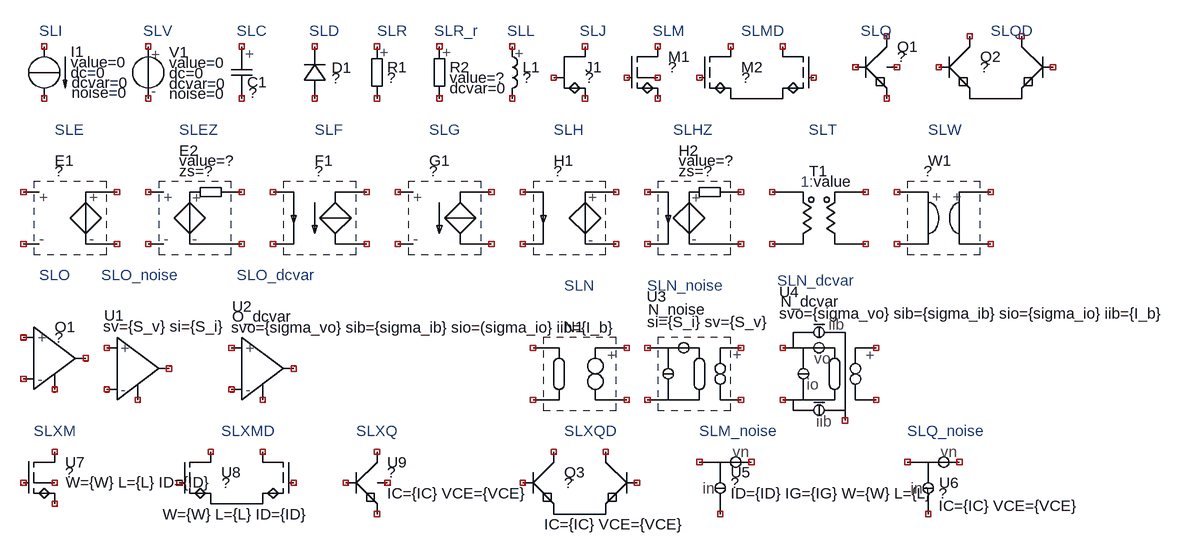
[diagram p0: schematic SLiCAPsymbolsLTSpice.asc]
SLiCAPsymbolsLTSpice.asc, the LTspice schematic file:
Version 4
SHEET 1 1264 1580
SYMBOL SLC -528 -320 R0
WINDOW 3 11 71 Left 2
SYMATTR InstName C1
SYMBOL SLE -784 -112 R0
SYMATTR InstName E1
SYMBOL SLI -832 -320 R0
SYMATTR InstName I1
SYMBOL SLD -416 -320 R0
SYMATTR InstName D1
SYMBOL SLF -400 -112 R0
SYMATTR InstName F1
SYMBOL SLG -208 -112 R0
SYMATTR InstName G1
SYMBOL SLH -16 -112 R0
SYMATTR InstName H1
SYMBOL SLEZ -592 -112 R0
SYMATTR InstName E2
SYMBOL SLHZ 176 -112 R0
SYMATTR InstName H2
SYMBOL SLJ -48 -320 R0
SYMATTR InstName J1
SYMBOL SLL -112 -240 R0
SYMATTR InstName L1
SYMBOL SLM 64 -272 R0
SYMATTR InstName M1
SYMBOL SLV -672 -320 R0
SYMATTR InstName V1
SYMBOL SLMD 176 -272 R0
SYMATTR InstName M2
SYMATTR Description MOSFET transistor
SYMBOL SLN 0 128 R0
SYMATTR InstName N1
SYMBOL SLO -848 160 R0
SYMATTR InstName O1
SYMBOL SLQ 416 -288 R0
SYMATTR InstName Q1
SYMBOL SLQD 544 -336 R0
SYMATTR InstName Q2
SYMBOL SLR -320 -320 R0
SYMATTR InstName R1
SYMBOL SLR_r -224 -320 R0
SYMATTR InstName R2
SYMBOL SLT 368 -112 R0
SYMATTR InstName T1
SYMBOL SLW 544 -112 R0
SYMATTR InstName W1
SYMBOL SLN_noise 176 128 R0
WINDOW 0 -81 -63 Left 2
WINDOW 38 -79 -43 Left 2
WINDOW 3 -80 -24 Left 2
SYMATTR InstName U3
SYMBOL SLN_dcvar 304 224 R0
WINDOW 0 -5 -166 Left 2
WINDOW 3 -5 -133 Left 2
WINDOW 38 -3 -151 Left 2
SYMATTR InstName U4
SYMBOL SLO_noise -720 176 R0
WINDOW 0 -20 -82 Left 2
WINDOW 3 -21 -65 Left 2
SYMATTR InstName U1
SYMBOL SLM_noise 256 304 R0
SYMATTR InstName U5
SYMBOL SLQ_noise 576 304 R0
SYMATTR InstName U6
SYMBOL SLXM -864 352 R0
SYMATTR InstName U7
SYMBOL SLXMD -624 352 R0
SYMATTR InstName U8
SYMBOL SLXQ -368 352 R0
SYMATTR InstName U9
SYMBOL SLXQD -96 304 R0
SYMATTR InstName Q3
SYMBOL SLO_dcvar -528 176 R0
SYMATTR InstName U2
TEXT -840 -344 Left 2 ;SLI
TEXT -680 -344 Left 2 ;SLV
TEXT -536 -344 Left 2 ;SLC
TEXT -424 -344 Left 2 ;SLD
TEXT -320 -344 Left 2 ;SLR
TEXT -232 -344 Left 2 ;SLR_r
TEXT -120 -344 Left 2 ;SLL
TEXT -8 -344 Left 2 ;SLJ
TEXT 104 -344 Left 2 ;SLM
TEXT 240 -344 Left 2 ;SLMD
TEXT 424 -344 Left 2 ;SLQ
TEXT 624 -344 Left 2 ;SLQD
TEXT -816 -192 Left 2 ;SLE
TEXT -624 -192 Left 2 ;SLEZ
TEXT -416 -192 Left 2 ;SLF
TEXT -240 -192 Left 2 ;SLG
TEXT -48 -192 Left 2 ;SLH
TEXT 136 -192 Left 2 ;SLHZ
TEXT 344 -192 Left 2 ;SLT
TEXT 528 -192 Left 2 ;SLW
TEXT -840 32 Left 2 ;SLO
TEXT -744 32 Left 2 ;SLO_noise
TEXT -536 32 Left 2 ;SLO_dcvar
TEXT -32 48 Left 2 ;SLN
TEXT 96 48 Left 2 ;SLN_noise
TEXT 296 40 Left 2 ;SLN_dcvar
TEXT -352 272 Left 2 ;SLXQ
TEXT -560 272 Left 2 ;SLXMD
TEXT -848 272 Left 2 ;SLXM
TEXT -32 272 Left 2 ;SLXQD
TEXT 176 272 Left 2 ;SLM_noise
TEXT 496 272 Left 2 ;SLQ_noise

The netlist it stands for:
* SLiCAPsymbolsLTSpice.asc
C1 NC_01 NC_02 ?
E1 NC_03 NC_04 NC_05 NC_06 ?
I1 NC_07 NC_08 I value=0 dc=0 dcvar=0 noise=0
D1 NC_09 NC_10 ?
F1 NC_11 NC_12 NC_13 NC_14 ?
G1 NC_15 NC_16 NC_17 NC_18 ?
H1 NC_19 NC_20 NC_21 NC_22 ?
E2 NC_23 NC_24 NC_25 NC_26 EZ value=? zs=?
H2 NC_27 NC_28 NC_29 NC_30 HZ value=? zs=?
J1 NC_31 NC_32 NC_33 ?
L1 NC_34 NC_35 ?
M1 NC_36 NC_37 NC_38 NC_39 ?
V1 NC_40 NC_41 V value=0 dc=0 dcvar=0 noise=0
M2 NC_42 NC_43 NC_44 NC_45 ?
N1 NC_46 NC_47 NC_48 NC_49
O1 NC_50 NC_51 NC_52 NC_53 ?
Q1 NC_54 NC_55 NC_56 NC_57 ?
Q2 NC_58 NC_59 NC_60 NC_61 ?
R1 NC_62 NC_63 ?
R2 NC_64 NC_65 r value=? dcvar=0
T1 NC_66 NC_67 NC_68 NC_69 value
W1 NC_70 NC_71 NC_72 NC_73 ?
XU3 NC_74 NC_75 NC_76 NC_77 N_noise si={S_i} sv={S_v}  ; pins NC+ NC- + -
XU4 NC_78 NC_79 NC_80 NC_81 NC_82 N_dcvar svo={sigma_vo} sib={sigma_ib} sio={sigma_io} iib={I_b}  ; pins NC+ NC- + - common
XU1 NC_83 NC_84 NC_85 NC_86 O_noise sv={S_v} si={S_i}  ; pins NC+ NC- + -
XU5 NC_87 NC_88 NC_89 ? ID={ID} IG={IG} W={W} L={L}  ; pins ext comm int
XU6 NC_90 NC_91 NC_92 ? IC={IC} VCE={VCE}  ; pins ext comm int
XU7 NC_93 NC_94 NC_95 NC_96 ? W={W} L={L} ID={ID}  ; pins D G S B
XU8 NC_97 NC_98 NC_99 NC_100 ? W={W} L={L} ID={ID}  ; pins D1 D2 G1 G2
XU9 NC_101 NC_102 NC_103 NC_104 ? IC={IC} VCE={VCE}  ; pins C B E S
Q3 NC_105 NC_106 NC_107 NC_108 ? IC={IC} VCE={VCE}
XU2 NC_109 NC_110 NC_111 NC_112 O_dcvar svo={sigma_vo} sib={sigma_ib} sio=(sigma_io} iib={I_b}  ; pins NC+ NC- + -
.model D D
.lib standard.dio
.model NPN NPN
.model PNP PNP
.lib standard.bjt
.model NJF NJF
.model PJF PJF
.lib standard.jft
.model NMOS NMOS
.model PMOS PMOS
.lib standard.mos
* SLI
* SLV
* SLC
* SLD
* SLR
* SLR_r
* SLL
* SLJ
* SLM
* SLMD
* SLQ
* SLQD
* SLE
* SLEZ
* SLF
* SLG
* SLH
* SLHZ
* SLT
* SLW
* SLO
* SLO_noise
* SLO_dcvar
* SLN
* SLN_noise
* SLN_dcvar
* SLXQ
* SLXMD
* SLXM
* SLXQD
* SLM_noise
* SLQ_noise
.lib SLiCAP.lib
.backanno
.end